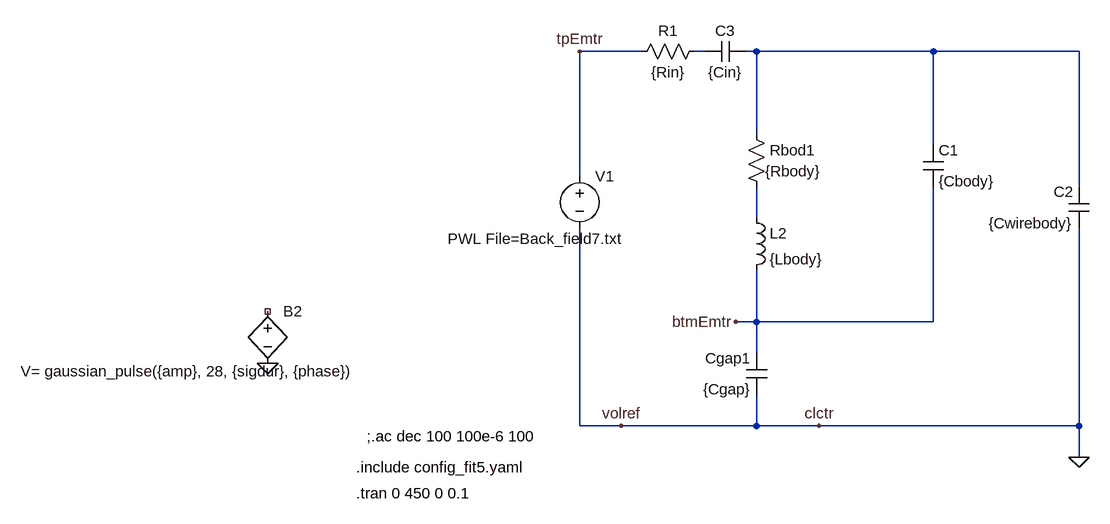
[diagram p0: schematic unitcell_PML_fit.asc]
unitcell_PML_fit.asc, the LTspice schematic file:
Version 4
SHEET 1 2592 1224
WIRE 192 240 96 240
WIRE 288 240 272 240
WIRE 368 240 352 240
WIRE 640 240 368 240
WIRE 864 240 640 240
WIRE 368 368 368 240
WIRE 640 384 640 240
WIRE 96 432 96 240
WIRE 864 448 864 240
WIRE 368 496 368 448
WIRE 368 656 368 576
WIRE 368 656 336 656
WIRE 640 656 640 448
WIRE 640 656 368 656
WIRE 368 704 368 656
WIRE 96 816 96 512
WIRE 160 816 96 816
WIRE 368 816 368 768
WIRE 368 816 160 816
WIRE 464 816 368 816
WIRE 864 816 864 512
WIRE 864 816 464 816
WIRE 864 864 864 816
FLAG 336 656 btmEmtr
FLAG 464 816 clctr
FLAG 96 240 tpEmtr
FLAG 160 816 volref
FLAG 864 864 0
FLAG -384 720 0
SYMBOL bv -384 624 R0
WINDOW 3 -380 108 Left 2
SYMATTR Value V= gaussian_pulse({amp}, 28, {sigdur}, {phase})
SYMATTR InstName B2
SYMBOL cap 624 384 R0
SYMATTR InstName C1
SYMATTR Value {Cbody}
SYMBOL cap 384 768 R180
WINDOW 0 24 56 Left 2
WINDOW 3 24 8 Left 2
SYMATTR InstName Cgap1
SYMATTR Value {Cgap}
SYMBOL cap 880 512 R180
WINDOW 0 24 56 Left 2
WINDOW 3 24 8 Left 2
SYMATTR InstName C2
SYMATTR Value {Cwirebody}
SYMBOL res 352 352 R0
WINDOW 3 29 72 Left 2
SYMATTR Value {Rbody}
SYMATTR InstName Rbod1
SYMBOL ind 352 480 R0
SYMATTR InstName L2
SYMATTR Value {Lbody}
SYMBOL res 288 224 R90
WINDOW 0 0 56 VBottom 2
WINDOW 3 32 56 VTop 2
SYMATTR InstName R1
SYMATTR Value {Rin}
SYMBOL voltage 96 416 R0
WINDOW 123 -203 112 Left 2
WINDOW 39 0 0 Left 0
SYMATTR Value2 PWL File=Back_field7.txt
SYMATTR InstName V1
SYMATTR Value ""
SYMBOL cap 352 224 R90
WINDOW 0 0 32 VBottom 2
WINDOW 3 32 32 VTop 2
SYMATTR InstName C3
SYMATTR Value {Cin}
TEXT -248 920 Left 2 !.tran 0 450 0 0.1
TEXT -248 880 Left 2 !.include config_fit5.yaml
TEXT -232 832 Left 2 !;.ac dec 100 100e-6 100

The netlist it stands for:
* unitcell_PML_fit.asc
B2 NC_01 0 V= gaussian_pulse({amp}, 28, {sigdur}, {phase})
C1 N002 btmEmtr {Cbody}
Cgap1 0 btmEmtr {Cgap}
C2 0 N002 {Cwirebody}
Rbod1 N002 N003 {Rbody}
L2 N003 btmEmtr {Lbody}
R1 N001 tpEmtr {Rin}
V1 tpEmtr 0 PWL File=Back_field7.txt
C3 N002 N001 {Cin}
.tran 0 450 0 0.1
.include config_fit5.yaml
;.ac dec 100 100e-6 100
.backanno
.end